# EAGLE design MPL115A1 (EAGLE 7.1.0)
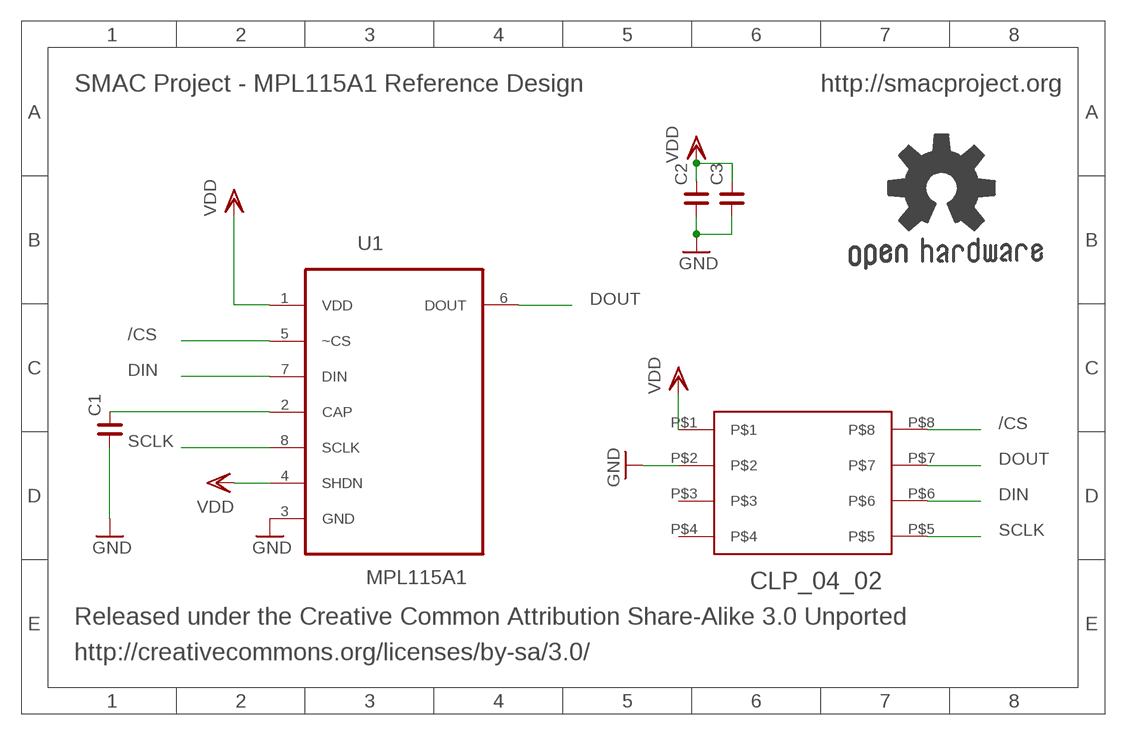
[diagram p0: schematic, sheet 1]

## Parts
C1  C_0402  [C0402]
C2  C_0402  [C0402]
C3  C_0402  [C0402]
GOLD_ORB_SM2  OSHWLOGO_REF_SM  [OSHW2REF]
U1  MPL115A1  [LGA8R125P0X4_500X300X120]
U$1  CLP_04_02  [CLP-104]

## Nets
/CS: U1.5(~CS) U$1.P$8
DIN: U1.7(DIN) U$1.P$6
DOUT: U1.6(DOUT) U$1.P$7
GND: C1.1 C2.1 C3.1 U1.3(GND) U$1.P$2
N$1: C1.2 U1.2(CAP)
SCLK: U1.8(SCLK) U$1.P$5
VDD: C2.2 C3.2 U1.1(VDD) U1.4(SHDN) U$1.P$1
Unconnected: U$1.P$3 U$1.P$4

## Notes on the sheet
- SMAC Project - MPL115A1 Reference Design | http://smacproject.org
- Released under the Creative Common Attribution Share-Alike 3.0 Unported
- http://creativecommons.org/licenses/by-sa/3.0/

## Library data of the parts
C1-C3 = rc-master-smd:C_: NON-POLARIZED CAP
GOLD_ORB_SM2 = bfl:OSHWLOGO: These are Open-Source Hardware logos.
U1 = MPL115A1:MPL115A1: Miniature SPI Digital Barometer; MPN: MPL115A1; OC_FARNELL: 1871576; OC_NEWARK: 69R5778; PACKAGESTYLE: LGA-8; SUPPLIER: Freescale
U$1 = CLP_104_Samtec:CLP_04_02

## Board
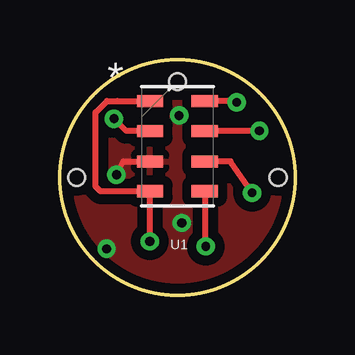
[diagram p1: board, top side]
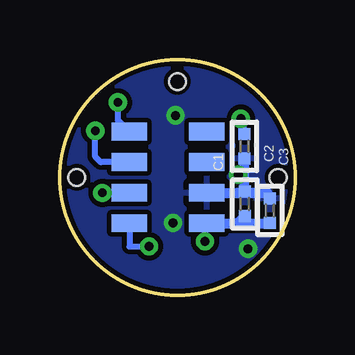
[diagram p2: board, bottom side, seen from below]

Size 9.8 x 9.8 mm. Coordinates in mm from the lower left corner, seen from the top.
Outline: circle at 4.9,4.9 radius 4.9
Copper layers (1*16): Top 0.035mm / dielectric 0.1mm / Bottom 0.035mm
Design rules "standard_4pcb": minimum track width 0.1mm, minimum drill 0.1mm, track to track 0.16mm, track to pad 0.16mm, pad to pad 0.15mm, via to via 0.15mm, smd to smd 0mil, copper to edge 0.1mm, drill to drill 0.1mm, minimum pad ring 0.13mm, minimum via ring 0.13mm, stop-mask expansion 0.015mm, vias tented up to drill 15mil, thermal gap 10mil
Holes 0.7 mm at 4.9,8.9 0.7,4.9 9.1,4.9

### Footprints (pad centres in the part's own frame; a part is rotated, then mirrored left to right if it is on the bottom)
C0402 = smd 0.5 x 0.5: 1 -0.508,0; 2 0.508,0
LGA8R125P0X4_500X300X120 = smd 1.092 x 0.508: 1 -1.143,1.88; 2 -1.143,0.635; 3 -1.143,-0.635; 4 -1.143,-1.88; 5 1.143,-1.88; 6 1.143,-0.635; 7 1.143,0.635; 8 1.143,1.88
CLP-104 = smd 1.47 x 0.74: P$1 -1.615,1.91; P$2 -1.615,0.64; P$3 -1.615,-0.64; P$4 -1.615,-1.91; P$5 1.615,-1.91; P$6 1.615,-0.64; P$7 1.615,0.64; P$8 1.615,1.91

### Placement (x,y rotation side)
C1  2.1,6.2 90 bottom
C2  2.09,3.79 270 bottom
C3  1.04,3.52 270 bottom
GOLD_ORB_SM2  11.22,1.27 0 top
U1  4.9,6.2 0 top
U$1  5.29,4.9 180 bottom

### Tracks (layer width: path | path; a pad name or v marks a point on that pad's centre or on a via)
/CS  (via drill 0.36 pad 0.76)
  Top 0.254: v6.08,2.02 6.08,4.32 U1.5
  Bottom 0.254: U$1.P$8 6.9,2.02 v6.08,2.02
DIN  (via drill 0.36 pad 0.76)
  Top 0.254: U1.7 7.88,6.84 v8.32,6.85
  Bottom 0.254: U$1.P$6 8.09,5.54 8.32,5.77 v8.32,6.85
DOUT  (via drill 0.36 pad 0.76)
  Top 0.254: U1.6 7.12,5.57 v8.03,4.25
  Bottom 0.254: v8.03,4.25 8.02,4.25 U$1.P$7
GND  (via drill 0.38 pad 0.76)
  Top 0.254: v2.36,5.01 2.64,5.57 U1.3
  Bottom 0.254: U$1.P$2 2.38,4.26 | C1.1 2.05,5.64 v2.36,5.01
  Bottom 0.406: U$1.P$2 2.38,4.26 1.16,4.26 | 1.16,4.26 C3.1 | C1.1 2.1,4.31 C2.1 2.04,4.26 1.16,4.26
  other vias: 5.09,3 4.98,7.48 1.95,1.92
  pour Bottom (isolate 0.2): -0.03,4.95 arc-90 4.82,9.81 4.91,9.81 arc-90 9.8,4.91 9.8,4.89 arc-90 4.92,0.01 4.84,0.01 4.8,0.01 arc-90 -0.03,4.83
  pour Top (isolate 0.4): 0.05,4.97 arc-90 4.91,9.82 4.99,9.82 arc-90 9.89,4.93 9.89,4.91 arc-90 5,0.02 4.92,0.02 4.88,0.02 arc-90 0.06,4.85
N$1  (via drill 0.38 pad 0.76)
  Top 0.254: U1.2 2.92,6.84 2.85,6.84 2.77,6.84 v2.26,7.35
  Bottom 0.254: C1.2 2.13,6.74 2.13,7.35 v2.26,7.35
  Bottom 0.406: C1.2
SCLK  (via drill 0.36 pad 0.76)
  Top 0.254: U1.8 7.32,8.08 v7.38,8.03
  Bottom 0.254: v7.38,8.03 7.38,7.28 U$1.P$5
VDD  (via drill 0.38 pad 0.76)
  Top 0.254: v3.75,2.23 v3.76,2.23 U1.4 1.69,4.32 1.48,4.53 1.48,7.18 1.48,7.62 1.5,7.62 1.97,8.08 2.39,8.08 U1.1
  Bottom 0.254: v3.75,2.23 3.75,2.91 U$1.P$1
  Bottom 0.406: U$1.P$1 2.5,2.99 | 2.5,2.99 2.39,2.99 C2.2 2.08,3.28 | C3.2 1.06,2.99 2.5,2.99

### Text on the board
Reference: http://smacproject.org